# Altium schematic sheet 检测板.SchDoc
size A4
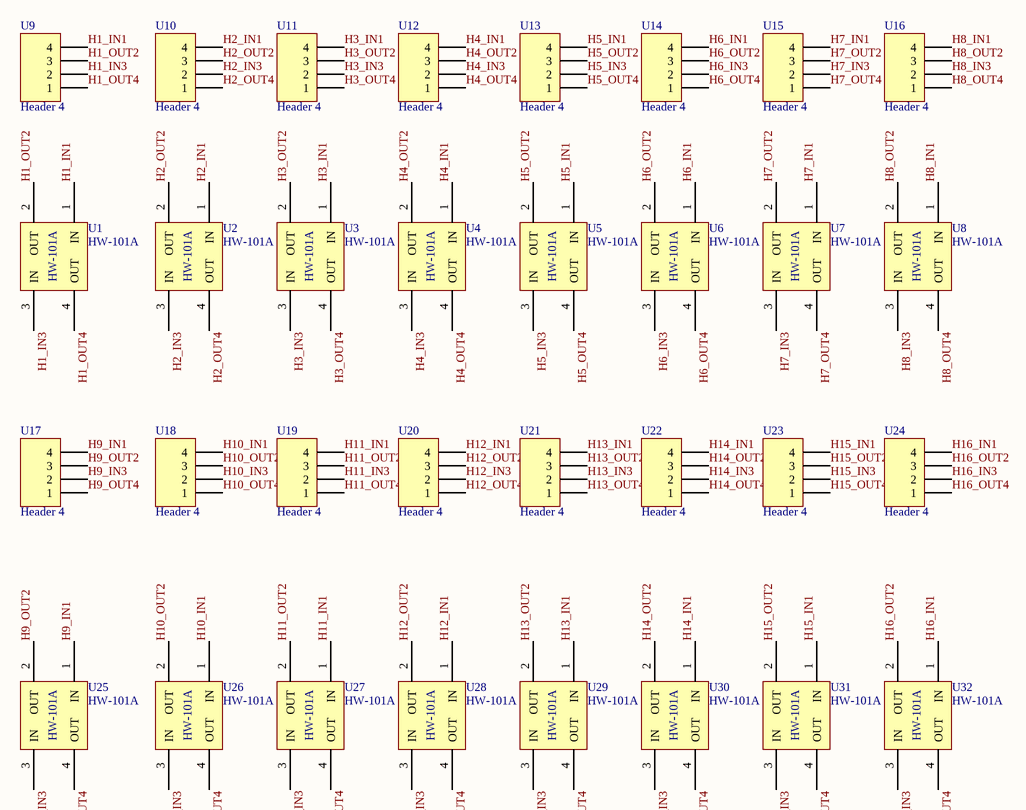
[diagram p0: 检测板.SchDoc]

## Parts
U1  HW-101A  [SOT-23-4]
U2  HW-101A  [SOT-23-4]
U3  HW-101A  [SOT-23-4]
U4  HW-101A  [SOT-23-4]
U5  HW-101A  [SOT-23-4]
U6  HW-101A  [SOT-23-4]
U7  HW-101A  [SOT-23-4]
U8  HW-101A  [SOT-23-4]
U9  Header 4  [PIN4]
U10  Header 4  [PIN4]
U11  Header 4  [PIN4]
U12  Header 4  [PIN4]
U13  Header 4  [PIN4]
U14  Header 4  [PIN4]
U15  Header 4  [PIN4]
U16  Header 4  [PIN4]
U17  Header 4  [PIN4]
U18  Header 4  [PIN4]
U19  Header 4  [PIN4]
U20  Header 4  [PIN4]
U21  Header 4  [PIN4]
U22  Header 4  [PIN4]
U23  Header 4  [PIN4]
U24  Header 4  [PIN4]
U25  HW-101A  [SOT-23-4]
U26  HW-101A  [SOT-23-4]
U27  HW-101A  [SOT-23-4]
U28  HW-101A  [SOT-23-4]
U29  HW-101A  [SOT-23-4]
U30  HW-101A  [SOT-23-4]
U31  HW-101A  [SOT-23-4]
U32  HW-101A  [SOT-23-4]

## Nets
H1_IN1: U1.1(IN) U9.4
H1_IN3: U1.3(IN) U9.2
H1_OUT2: U1.2(OUT) U9.3
H1_OUT4: U1.4(OUT) U9.1
H2_IN1: U2.1(IN) U10.4
H2_IN3: U2.3(IN) U10.2
H2_OUT2: U2.2(OUT) U10.3
H2_OUT4: U2.4(OUT) U10.1
H3_IN1: U3.1(IN) U11.4
H3_IN3: U3.3(IN) U11.2
H3_OUT2: U3.2(OUT) U11.3
H3_OUT4: U3.4(OUT) U11.1
H4_IN1: U4.1(IN) U12.4
H4_IN3: U4.3(IN) U12.2
H4_OUT2: U4.2(OUT) U12.3
H4_OUT4: U4.4(OUT) U12.1
H5_IN1: U5.1(IN) U13.4
H5_IN3: U5.3(IN) U13.2
H5_OUT2: U5.2(OUT) U13.3
H5_OUT4: U5.4(OUT) U13.1
H6_IN1: U6.1(IN) U14.4
H6_IN3: U6.3(IN) U14.2
H6_OUT2: U6.2(OUT) U14.3
H6_OUT4: U6.4(OUT) U14.1
H7_IN1: U7.1(IN) U15.4
H7_IN3: U7.3(IN) U15.2
H7_OUT2: U7.2(OUT) U15.3
H7_OUT4: U7.4(OUT) U15.1
H8_IN1: U8.1(IN) U16.4
H8_IN3: U8.3(IN) U16.2
H8_OUT2: U8.2(OUT) U16.3
H8_OUT4: U8.4(OUT) U16.1
H9_IN1: U17.4 U25.1(IN)
H9_IN3: U17.2 U25.3(IN)
H9_OUT2: U17.3 U25.2(OUT)
H9_OUT4: U17.1 U25.4(OUT)
H10_IN1: U18.4 U26.1(IN)
H10_IN3: U18.2 U26.3(IN)
H10_OUT2: U18.3 U26.2(OUT)
H10_OUT4: U18.1 U26.4(OUT)
H11_IN1: U19.4 U27.1(IN)
H11_IN3: U19.2 U27.3(IN)
H11_OUT2: U19.3 U27.2(OUT)
H11_OUT4: U19.1 U27.4(OUT)
H12_IN1: U20.4 U28.1(IN)
H12_IN3: U20.2 U28.3(IN)
H12_OUT2: U20.3 U28.2(OUT)
H12_OUT4: U20.1 U28.4(OUT)
H13_IN1: U21.4 U29.1(IN)
H13_IN3: U21.2 U29.3(IN)
H13_OUT2: U21.3 U29.2(OUT)
H13_OUT4: U21.1 U29.4(OUT)
H14_IN1: U22.4 U30.1(IN)
H14_IN3: U22.2 U30.3(IN)
H14_OUT2: U22.3 U30.2(OUT)
H14_OUT4: U22.1 U30.4(OUT)
H15_IN1: U23.4 U31.1(IN)
H15_IN3: U23.2 U31.3(IN)
H15_OUT2: U23.3 U31.2(OUT)
H15_OUT4: U23.1 U31.4(OUT)
H16_IN1: U24.4 U32.1(IN)
H16_IN3: U24.2 U32.3(IN)
H16_OUT2: U24.3 U32.2(OUT)
H16_OUT4: U24.1 U32.4(OUT)

## Library data of the parts
U9-U24 = Header 4: Header, 4-Pin; LatestRevisionDate: 17-Jul-2002; LatestRevisionNote: Re-released for DXP Platform.; Publisher: Altium Limited